# Altium schematic sheet SAMV71_Xplained_Ultra_CAN.SchDoc: CAN
size A3; Organization: Microchip Norway; Address1: Vestre Rosten 79; Address2: N-7075 TILLER; Address3: NORWAY; DocumentNumber: A09-2407; Revision: 12; SheetNumber: 12; SheetTotal: 13; DrawnBy: Microchip Norway; Engineer: AH; PageSetup: Record=PageOptions|CenterHorizontal=True|CenterVertical=True|PrintScale=1.01|XCorrection=1.00|YCorrection=1.00|PrintKind=1|BorderSize=5000000|LeftOffset=0|BottomOffset=0|Orientation=2|PaperLength=1000|PaperWidth=1000|Scale=100|PaperSource=7|PrintQuality=-4|MediaType=1|DitherType=10|PaperKind=A3 (297 x 420 mm)|PrintScaleMode=1; ProjectTitle: SAM V71 Xplained Ultra; PCBNumber: A08-2216; PCBRevision: 4; ProjectName: SAM3X Xplained Pro
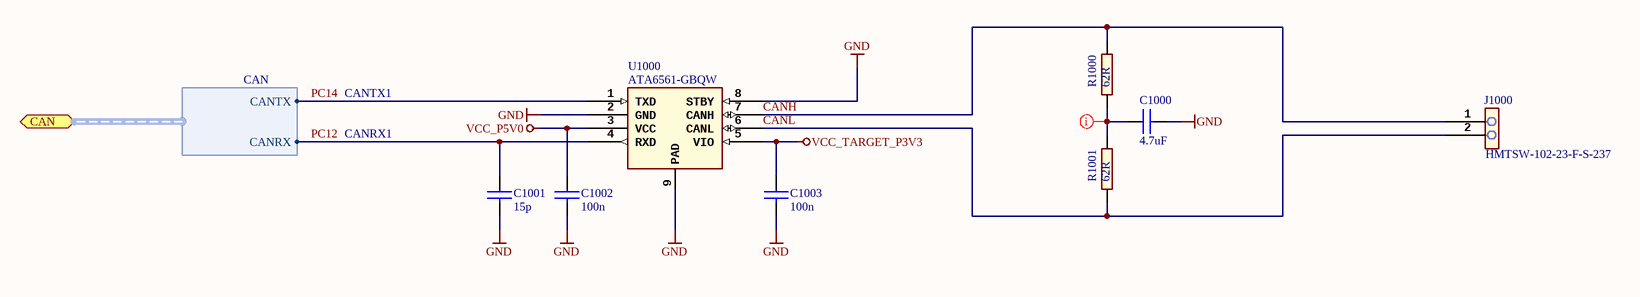
[diagram p0: SAMV71_Xplained_Ultra_CAN.SchDoc]

## Parts
C1000  value 4.7uF  [AP1-00003]
C1001  value 15p  [AP1-00001]
C1002  value 100n  [AP1-00001]
C1003  value 100n  [AP1-00001]
J1000  value HMTSW-102-23-F-S-237  [AP8-00733]
R1000  value 62R  [AP2-00008]  (hidden comment: Generic component)
R1001  value 62R  [AP2-00008]  (hidden comment: Generic component)
U1000  value ATA6561-GBQW  [AP6-00407]

## Ports
CAN (harness CAN)

## Harnesses
CAN: CANTX, CANRX

## Nets
GND: C1000.2 C1001.2 C1002.2 C1003.2 U1000.2(GND) U1000.8(STBY) U1000.9(PAD)
VCC_P5V0: C1002.1 U1000.3(VCC)
VCC_TARGET_P3V3: C1003.1 U1000.5(VIO)
CANH: J1000.1 R1000.2 U1000.7(CANH)
CANL: J1000.2 R1001.1 U1000.6(CANL)
PC12: C1001.1 U1000.4(RXD) ; port CAN.CANRX
PC14: U1000.1(TXD) ; port CAN.CANTX
NetC1000_1: C1000.1 R1000.1 R1001.2

## Layout directives
rule Fabrication Testpoint Usage [Testpoint - Not Allowed    Multiple - Not Allowed]; rule Assembly Testpoint Usage [Testpoint - Not Allowed    Multiple - Not Allowed]: NetC1000_1

## Notes on the sheet
- CANTX1
- CANRX1
- Drawn By:
- Project Title
- Engineer:
- Designed with
- Sheet Title
- Size
- A3
- PCB Number:
- PCB Assembly Number:
- PCBA Revision:
- PCB    Revision:
- Date:
- Altium.com <http://go.altium.com/MicrochipLandingPage_Evaluation.html>
- File:
- Page:

## Library data of the parts
C1000 = A01-0400: Ceramic capacitor, SMD 0805, X5R, 25V, ±10 %; PartGroup: Capacitors,Ceramic,SMD 0805; Manufacturer: Murata; MPN: GRM21BR61E475KA12L; Tolerance: Â±10%; AN: A01-0400; Height: 1,25
C1001 = A01-0017: Ceramic capacitor, SMD 0402, NP0, 50V, +/-5%; PartGroup: Capacitors,Ceramic,SMD 0402; Manufacturer: AVX; MPN: 04025A150JAT2A; TemperatureRange: -55 - +125 deg C; AN: A01-0017; Tolerance: 50V, +/-5%; Height: 0,550000011920929
C1002 C1003 = A01-0246: Ceramic capacitor, SMD 0402, X7R, 16V, +/-10%; PartGroup: Capacitors,Ceramic,SMD 0402; Manufacturer: Kemet; MPN: C0402C104K4RACTU; TemperatureRange: -55 - +125 deg C; AN: A01-0246; Tolerance: 16V, +/-10%; Height: 0,5
J1000 = A08-1754: 1x2 pin header, 2.54mm pitch, Pin-in-Paste THM; PartGroup: Mechanical devices,Connectors,Pin headers; Manufacturer: SAMTEC; TemperatureRange: - 55 deg C to + 125 deg C; AN: A08-1754; Height: 6,09999990463257; MPN: HMTSW-102-23-F-S-237
R1000 R1001 = A02-0760: Thick film resistor, SMD 1210, 0.5W, 1%; PartGroup: Resistors,SMD,1210 1%; Manufacturer: vishay; MPN: CRCW121062R0FKEAHP; TemperatureRange: -55°C to +155°C; AN: A02-0760; Tolerance: 1%; Height: 0,699999988079071
U1000 = A06-1172: 5Mbit/s CAN Trasceiver,VCC = 5V, VIO = 2.8-5V, 3x3 mm VDFN8; PartGroup: Integrated Circuits,Interface ICs,CAN; Manufacturer: ATMEL; AN: A06-1172; Height: 0,899999976158142; MPN: ATA6561-GBQW